# EAGLE design usb_hub (EAGLE 8.5.0)
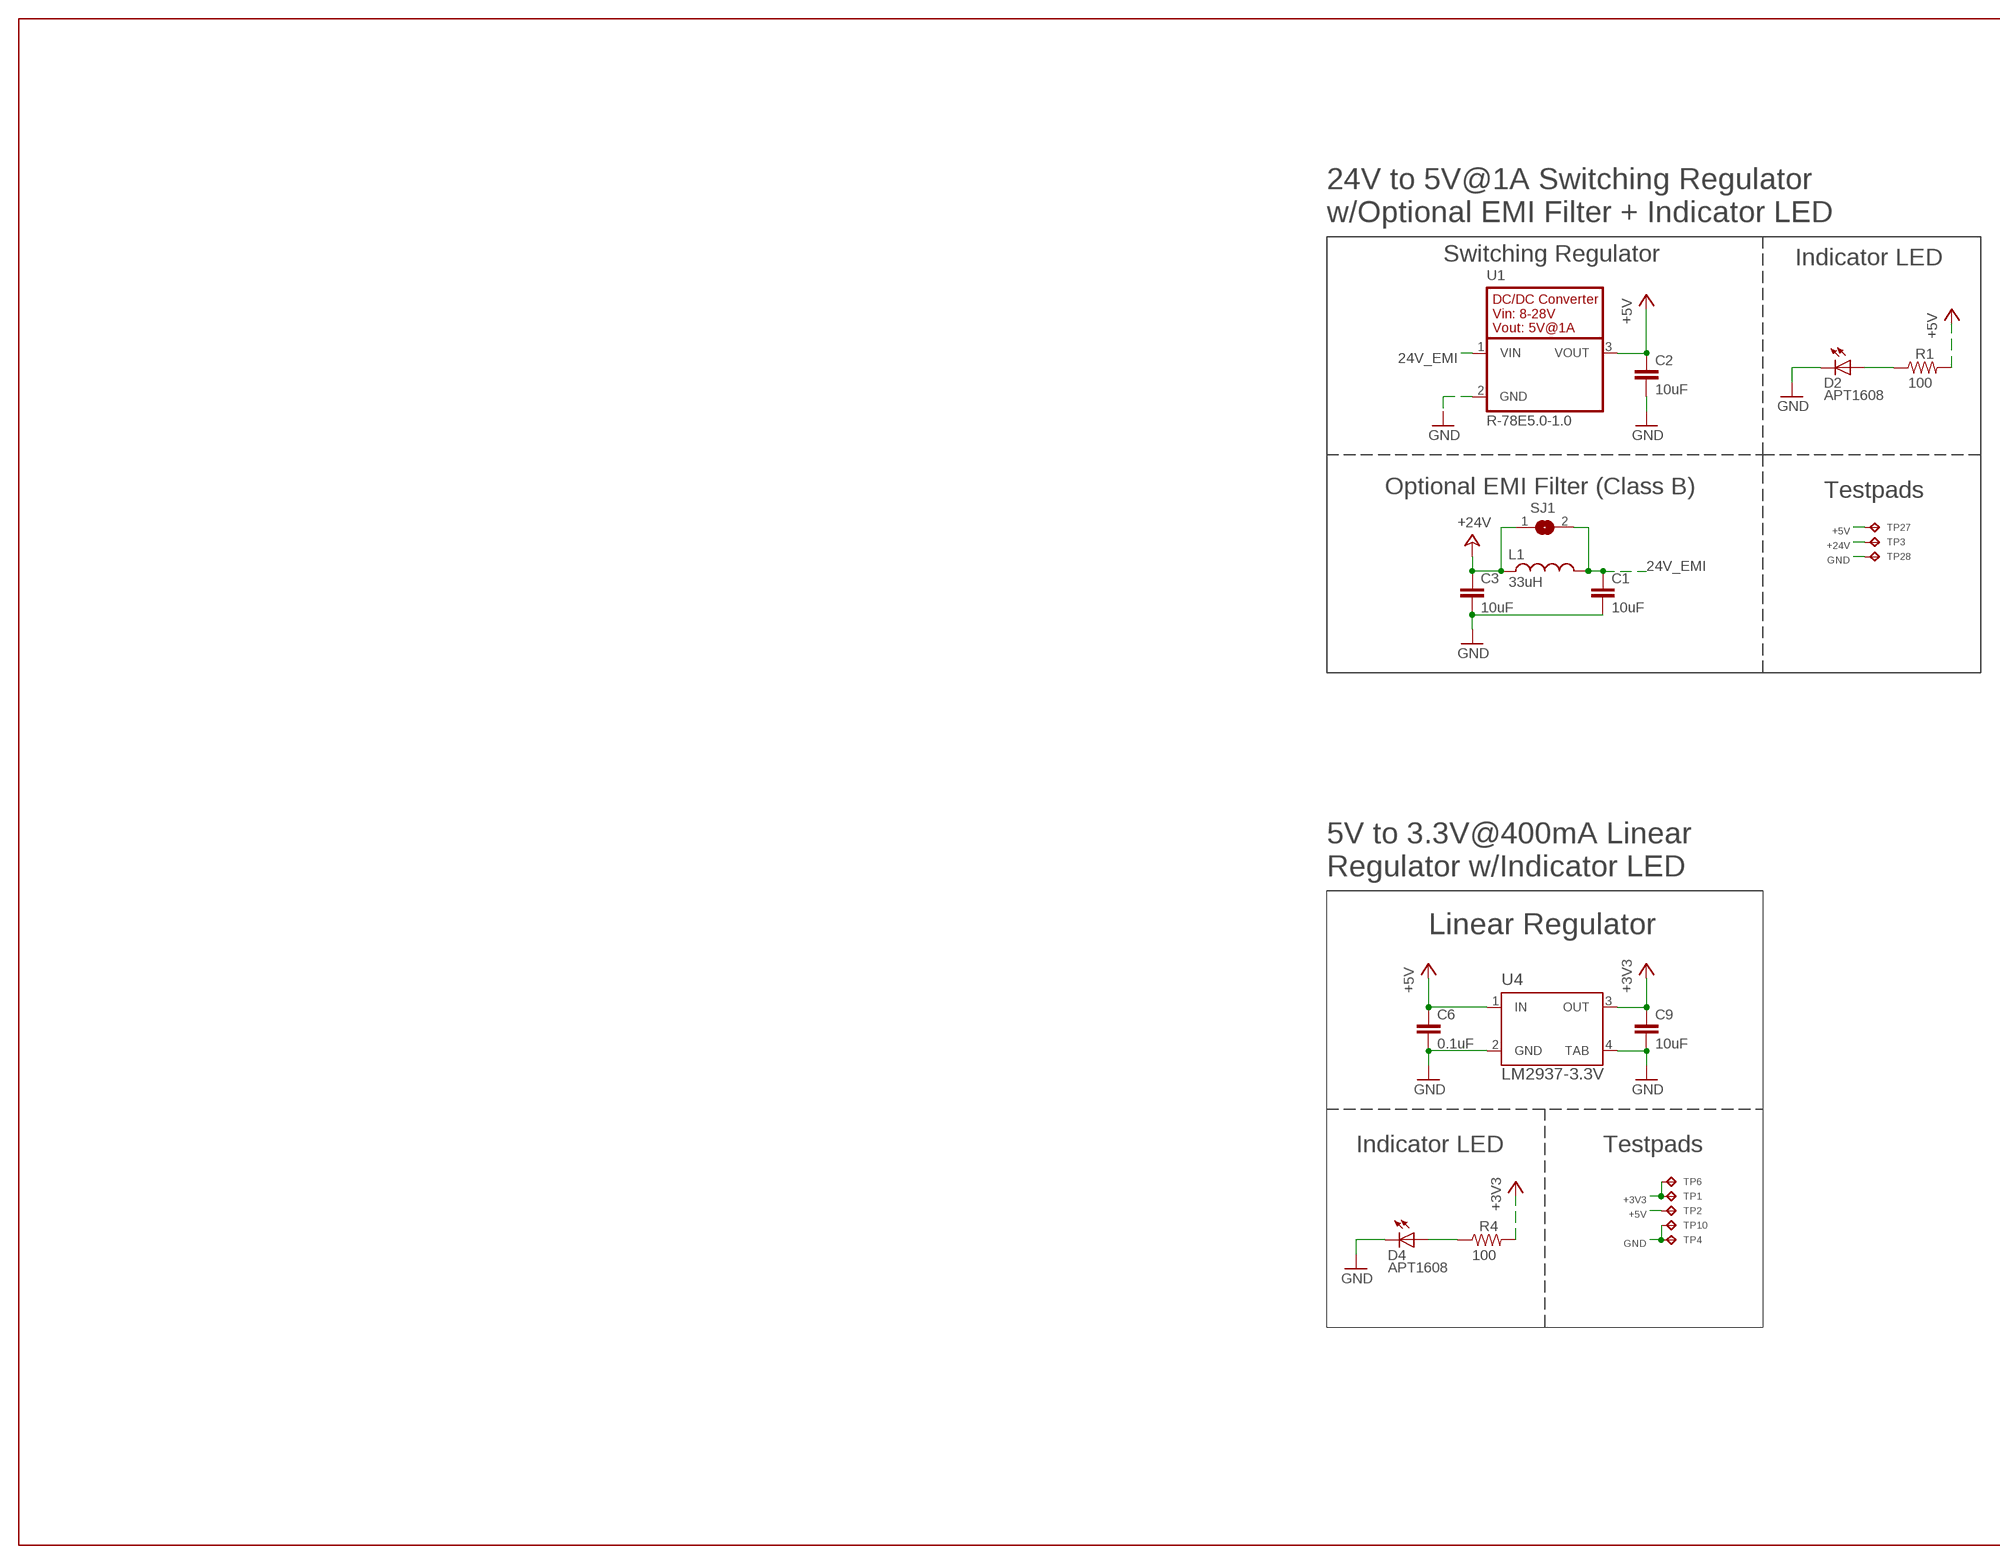
[diagram p0: schematic, sheet 1, part 1 of 2]
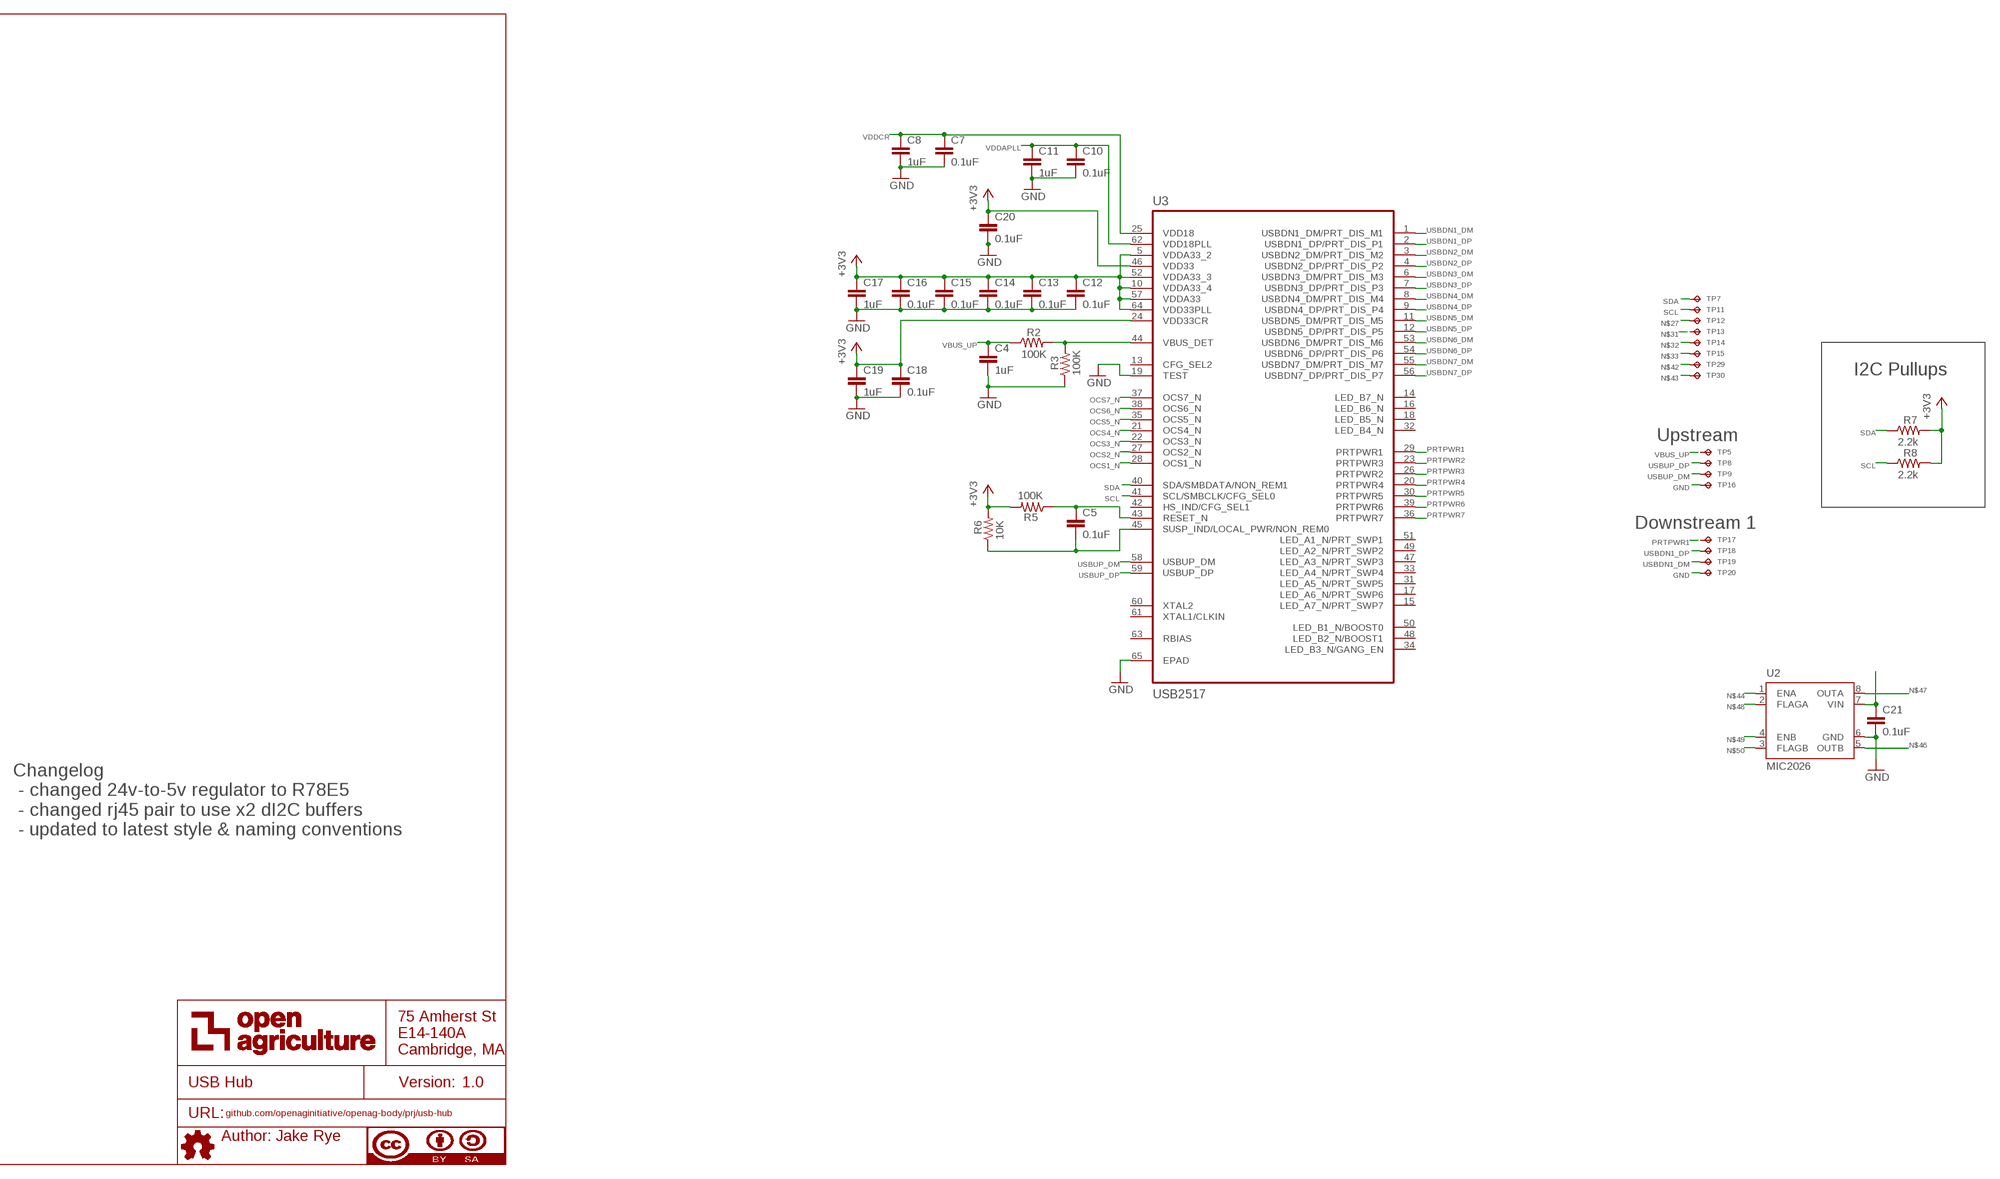
[diagram p1: schematic, sheet 1, part 2 of 2]

## Parts
C1  10uF  10UF-GMK212BBJ106KG-T  [C0805]
C2  10uF  10UF-GMK212BBJ106KG-T  [C0805]
C3  10uF  10UF-GMK212BBJ106KG-T  [C0805]
C4  1uF  1UF-CL10A105KB8NNNC  [C0603]
C5  0.1uF  0.1UF-C0603C104K5RACTU  [C0603]
C6  0.1uF  0.1UF-C0603C104K5RACTU  [C0603]
C7  0.1uF  0.1UF-C0603C104K5RACTU  [C0603]
C8  1uF  1UF-CL10A105KB8NNNC  [C0603]
C9  10uF  10UF-GMK212BBJ106KG-T  [C0805]
C10  0.1uF  0.1UF-C0603C104K5RACTU  [C0603]
C11  1uF  1UF-CL10A105KB8NNNC  [C0603]
C12  0.1uF  0.1UF-C0603C104K5RACTU  [C0603]
C13  0.1uF  0.1UF-C0603C104K5RACTU  [C0603]
C14  0.1uF  0.1UF-C0603C104K5RACTU  [C0603]
C15  0.1uF  0.1UF-C0603C104K5RACTU  [C0603]
C16  0.1uF  0.1UF-C0603C104K5RACTU  [C0603]
C17  1uF  1UF-CL10A105KB8NNNC  [C0603]
C18  0.1uF  0.1UF-C0603C104K5RACTU  [C0603]
C19  1uF  1UF-CL10A105KB8NNNC  [C0603]
C20  0.1uF  0.1UF-C0603C104K5RACTU  [C0603]
C21  0.1uF  0.1UF-C0603C104K5RACTU  [C0603]
D2  APT1608  APT1608CGCK  [CHIPLED_0603]
D4  APT1608  APT1608CGCK  [CHIPLED_0603]
L1  33uH  33UH-29333C  [29333C]
R1  100  100OHM-RC0603JR-07100RL  [RC0603N]
R2  100K  100K-RC0603FR-07100KL  [RC0603N]
R3  100K  100K-RC0603FR-07100KL  [RC0603N]
R4  100  100OHM-RC0603JR-07100RL  [RC0603N]
R5  100K  100K-RC0603FR-07100KL  [RC0603N]
R6  10K  10K-ERJ-3EKF1002V  [RC0603N]
R7  2.2k  2.2K-RC0603JR-072K2L  [RC0603N]
R8  2.2k  2.2K-RC0603JR-072K2L  [RC0603N]
SJ1  SOLDERJUMPERREFLOW_NOPASTE  [SJ1]
TP1  TPTP04R  [TP04R]
TP2  TPTP04R  [TP04R]
TP3  TPTP06R  [TP06R]
TP4  TPTP04R  [TP04R]
TP5  TPTP04R  [TP04R]
TP6  TPTP04R  [TP04R]
TP7  TPTP04R  [TP04R]
TP8  TPTP04R  [TP04R]
TP9  TPTP04R  [TP04R]
TP10  TPTP04R  [TP04R]
TP11  TPTP04R  [TP04R]
TP12  TPTP04R  [TP04R]
TP13  TPTP04R  [TP04R]
TP14  TPTP04R  [TP04R]
TP15  TPTP04R  [TP04R]
TP16  TPTP04R  [TP04R]
TP17  TPTP04R  [TP04R]
TP18  TPTP04R  [TP04R]
TP19  TPTP04R  [TP04R]
TP20  TPTP04R  [TP04R]
TP27  TPTP06R  [TP06R]
TP28  TPTP06R  [TP06R]
TP29  TPTP04R  [TP04R]
TP30  TPTP04R  [TP04R]
U1  R-78E5.0-1.0  [R-78E5.0-1.0]
U2  MIC2026  MIC2026-1YM-TR  [SOIC8]
U3  USB2517  USB2517-JZX  [QFN50P900X900X100-65N]
U4  LM2937-3.3V  LM2937IMP-3.3/NOPB  [MP04A]
U$6  AUTHOR  [AUTHOR]
U$7  TITLE  [TITLE]

## Nets
24V_EMI: C1.1 L1.2 SJ1.2 U1.1(VIN)
+3V3: C9.1 C12.1 C13.1 C14.1 C15.1 C16.1 C17.1 C18.1 C19.1 C20.1 R4.2 R5.2 R6.2 R7.2 R8.2 TP1.1(TP) TP6.1(TP) U3.5(VDDA33_2) U3.10(VDDA33_4) U3.24(VDD33CR) U3.46(VDD33) U3.52(VDDA33_3) U3.57(VDDA33) U3.64(VDD33PLL) U4.3(OUT)
+5V: C2.1 C6.1 R1.2 TP2.1(TP) TP27.TP U1.3(VOUT) U4.1(IN)
+24V: C3.1 L1.1 SJ1.1 TP3.TP
GND: C1.2 C2.2 C3.2 C4.2 C6.2 C7.2 C8.2 C9.2 C10.2 C11.2 C12.2 C13.2 C14.2 C15.2 C16.2 C17.2 C18.2 C19.2 C20.2 C21.2 D2.C D4.C R3.1 TP4.1(TP) TP10.1(TP) TP16.1(TP) TP20.1(TP) TP28.TP U1.2(GND) U2.6(GND) U3.19(TEST) U3.65(EPAD) U4.2(GND) U4.4(TAB)
N$4: R2.2 R3.2 U3.44(VBUS_DET)
N$5: D4.A R4.1
N$6: D2.A R1.1
N$7: C5.1 R5.1 U3.43(RESET_N)
N$11: C21.1 U2.7(VIN)
N$27: TP12.1(TP)
N$31: TP13.1(TP)
N$32: TP14.1(TP)
N$33: TP15.1(TP)
N$42: TP29.1(TP)
N$43: TP30.1(TP)
N$44: U2.1(ENA)
N$45: C5.2 R6.1 U3.45(SUSP_IND/LOCAL_PWR/NON_REM0)
N$46: U2.5(OUTB)
N$47: U2.8(OUTA)
N$48: U2.2(FLAGA)
N$49: U2.4(ENB)
N$50: U2.3(FLAGB)
OCS1_N: U3.28(OCS1_N)
OCS2_N: U3.27(OCS2_N)
OCS3_N: U3.22(OCS3_N)
OCS4_N: U3.21(OCS4_N)
OCS5_N: U3.35(OCS5_N)
OCS6_N: U3.38(OCS6_N)
OCS7_N: U3.37(OCS7_N)
PRTPWR1: TP17.1(TP) U3.29(PRTPWR1)
PRTPWR2: U3.23(PRTPWR3)
PRTPWR3: U3.26(PRTPWR2)
PRTPWR4: U3.20(PRTPWR4)
PRTPWR5: U3.30(PRTPWR5)
PRTPWR6: U3.39(PRTPWR6)
PRTPWR7: U3.36(PRTPWR7)
SCL: R8.1 TP11.1(TP) U3.41(SCL/SMBCLK/CFG_SEL0)
SDA: R7.1 TP7.1(TP) U3.40(SDA/SMBDATA/NON_REM1)
USBDN1_DM: TP19.1(TP) U3.1(USBDN1_DM/PRT_DIS_M1)
USBDN1_DP: TP18.1(TP) U3.2(USBDN1_DP/PRT_DIS_P1)
USBDN2_DM: U3.3(USBDN2_DM/PRT_DIS_M2)
USBDN2_DP: U3.4(USBDN2_DP/PRT_DIS_P2)
USBDN3_DM: U3.6(USBDN3_DM/PRT_DIS_M3)
USBDN3_DP: U3.7(USBDN3_DP/PRT_DIS_P3)
USBDN4_DM: U3.8(USBDN4_DM/PRT_DIS_M4)
USBDN4_DP: U3.9(USBDN4_DP/PRT_DIS_P4)
USBDN5_DM: U3.11(USBDN5_DM/PRT_DIS_M5)
USBDN5_DP: U3.12(USBDN5_DP/PRT_DIS_P5)
USBDN6_DM: U3.53(USBDN6_DM/PRT_DIS_M6)
USBDN6_DP: U3.54(USBDN6_DP/PRT_DIS_P6)
USBDN7_DM: U3.55(USBDN7_DM/PRT_DIS_M7)
USBDN7_DP: U3.56(USBDN7_DP/PRT_DIS_P7)
USBUP_DM: TP9.1(TP) U3.58(USBUP_DM)
USBUP_DP: TP8.1(TP) U3.59(USBUP_DP)
VBUS_UP: C4.1 R2.1 TP5.1(TP)
VDDAPLL: C10.1 C11.1 U3.62(VDD18PLL)
VDDCR: C7.1 C8.1 U3.25(VDD18)
Unconnected: U3.13(CFG_SEL2) U3.14(LED_B7_N) U3.15(LED_A7_N/PRT_SWP7) U3.16(LED_B6_N) U3.17(LED_A6_N/PRT_SWP6) U3.18(LED_B5_N) U3.31(LED_A5_N/PRT_SWP5) U3.32(LED_B4_N) U3.33(LED_A4_N/PRT_SWP4) U3.34(LED_B3_N/GANG_EN) U3.42(HS_IND/CFG_SEL1) U3.47(LED_A3_N/PRT_SWP3) U3.48(LED_B2_N/BOOST1) U3.49(LED_A2_N/PRT_SWP2) U3.50(LED_B1_N/BOOST0) U3.51(LED_A1_N/PRT_SWP1) U3.60(XTAL2) U3.61(XTAL1/CLKIN) U3.63(RBIAS)

## Notes on the sheet
- 24V to 5V@1A Switching Regulator
  w/Optional EMI Filter + Indicator LED
- Switching Regulator | Indicator LED
- Optional EMI Filter (Class B) | Testpads | I2C Pullups
- Upstream
- Downstream 1
- 5V to 3.3V@400mA Linear 
  Regulator w/Indicator LED
- Linear Regulator
- Changelog
   - changed 24v-to-5v regulator to R78E5
   - changed rj45 pair to use x2 dI2C buffers
   - updated to latest style & naming conventions
- Indicator LED | Testpads

## Library data of the parts
C1-C3 C9 = openag-capacitors:10UF-GMK212BBJ106KG-T: CAP CER 10UF 35V X5R 0805 Description: 10µF ±10% 35V Ceramic Capacitor X5R 0805 (2012 Metric) Technical Specifications: Capacitance: 10µF Tolerance: ±10% Rated Voltage: 35V Temperature Coefficient: X5R Operating Temperature: -55°C ~ 85°C Package / Case: 0805 (2012 Metric) Datasheet(s): GMK212BBJ106KG-T Spec <http://ds.yuden.co.jp/TYCOMPAS/ut/detail.do?productNo=GMK212BBJ106KG-T&fileName=GMK212BBJ106KG-T_SS&mode=specSheetDownload> Vendor(s): Digikey: 587-4893-1-ND <https://www.digikey.com/product-detail/en/taiyo-yuden/GMK212BBJ106KG-T/587-4893-1-ND/6563736>; MANUFACTURER: Taiyo Yuden; MPN: GMK212BBJ106KG-T; VENDOR: Digikey; VLINK: https://www.digikey.com/product-detail/en/taiyo-yuden/GMK212BBJ106KG-T/587-4893-1-ND/6563736; VPN: 587-4893-1-ND
C4 C8 C11 C17 C19 = openag-capacitors:1UF-CL10A105KB8NNNC: CAP CER 1UF 50V X5R 0603 Description: 1µF ±10% 50V Ceramic Capacitor X5R 0603 (1608 Metric) Technical Specifications: Capacitance: 1µF Tolerance: ±10% Voltage - Rated: 50V Temperature Coefficient: X5R Operating Temperature: -55°C ~ 85°C Applications: General Purpose Mounting Type: Surface Mount, MLCC Package / Case: 0603 (1608 Metric) Size / Dimension: 0.063" L x 0.032" W (1.60mm x 0.80mm) Thickness (Max): 0.035" (0.90mm) Datasheet(s): CL10A105KB8NNNC Spec <http://www.samsungsem.com/kr/support/product-search/mlcc/CL10A105KB8NNNC.jsp> CL10A105KB8NNNC Characteristics <http://www.samsungsem.com/kr/front/downloadcms.do?path=/kr/support/product-search/mlcc/__icsFiles/afieldfile/2014/11/05&fileName=C_CL10A105KB8NNNC.pdf> MLCC Catalog <http://www.samsungsem.com/kr/support/library/product-catalog/mlcc.jsp> Vendor(s): Digikey: 1276-1860-1-ND <https://www.digikey.com/product-detail/en/samsung-electro-mechanics-america-inc/CL10A105KB8NNNC/1276-1860-1-ND/3889946>; MANUFACTURER: Samsung Electro-Mechanics; MPN: CL10A105KB8NNNC; VENDOR: Digikey; VLINK: https://www.digikey.com/product-detail/en/samsung-electro-mechanics-america-inc/CL10A105KB8NNNC/1276-1860-1-ND/3889946; VPN: 1276-1860-1-ND
C5-C7 C10 C12-C16 C18 C20 C21 = openag-capacitors:0.1UF-C0603C104K5RACTU: CAP CER 0.1UF 50V X7R 0603 Description: 0.1µF ±10% 50V Ceramic Capacitor X7R 0603 (1608 Metric) Technical Specifications: Capacitance: 0.1µF Tolerance: ±10% Rated Voltage: 50V Temperature Coefficient: X7R Operating Temperature: -55°C ~ 125°C Package / Case: 0603 (1608 Metric) Datasheet(s): X7R Dielectric, 6.3-250 VDC <https://search.kemet.com/component-edge/download/datasheet/C0603C104K5RACTU.pdf> Vendor(s): Digikey: 399-5089-1-ND <https://www.digikey.com/product-detail/en/kemet/C0603C104K5RACTU/399-5089-1-ND/1465623>; MANUFACTURER: Kemet; MPN: C0603C104K5RACTU; VENDOR: Digikey; VLINK: https://www.digikey.com/product-detail/en/kemet/C0603C104K5RACTU/399-5089-1-ND/1465623; VPN: 399-5089-1-ND
D2 D4 = openag-diodes:APT1608CGCK: LED GREEN CLEAR 0603 SMD Description: Green 570nm LED Indication - Discrete 2.1V 0603 (1608 Metric) Technical Specifications: Color: Green Lens Color: Colorless Lens Transparency: Clear Millicandela Rating: 50mcd Lens Style/Size: Rectangle with Flat Top, 1.20mm x 0.80mm Voltage - Forward (Vf) (Typ): 2.1V Current - Test: 20mA Viewing Angle: 120° Mounting Type: Surface Mount Wavelength - Dominant: 570nm Wavelength - Peak: 574nm Package / Case: 0603 (1608 Metric) Supplier Device Package: Chip LED Size / Dimension: 1.60mm L x 0.80mm W Height (Max): 0.75mm Datasheet(s): APT1608CGCK <http://www.kingbrightusa.com/images/catalog/SPEC/APT1608CGCK.pdf> Vendor(s): Digikey: 754-1116-1-ND <https://www.digikey.com/product-detail/en/kingbright/APT1608CGCK/754-1116-1-ND/1747833#>; MANUFACTURER: Kingbright; MPN: APT1608CGCK; VENDOR: Digikey; VLINK: https://www.digikey.com/product-detail/en/kingbright/APT1608CGCK/754-1116-1-ND/1747833#; VPN: 754-1116-1-ND
L1 = openag-inductors:33UH-29333C: FIXED IND 33UH 1A 120 MOHM SMD Description: 33µH Shielded Wirewound Inductor 1A 120 mOhm Max Nonstandard Technical Specifications: Type: Wirewound Inductance: 33µH Current Rating: 1A Shielding: Shielded DC Resistance (DCR): 120 mOhm Max Operating Temperature: -40°C ~ 85°C Frequency - Test: 10kHz Mounting Type: Surface Mount Package / Case: Nonstandard Size / Dimension: 0.283" L x 0.283" W (7.20mm x 7.20mm) Height - Seated (Max): 0.157" (4.00mm) Datasheet(s): 2900 Series <https://www.murata-ps.com/data/magnetics/kmp_2900.pdf> Vendor(s): Digikey: 811-1138-1-ND <https://www.digikey.com/product-detail/en/murata-power-solutions-inc/29333C/811-1138-1-ND/1924860>; MANUFACTURER: Murata Power Solutions Inc.; MPN: 29333C; VENDOR: Digikey; VLINK: https://www.digikey.com/product-detail/en/murata-power-solutions-inc/29333C/811-1138-1-ND/1924860; VPN: 811-1138-1-ND
R1 R4 = openag-resistors:100OHM-RC0603JR-07100RL: RES SMD 100 OHM 5% 1/10W 0603 Description: 100 Ohms ±5% 0.1W, 1/10W Chip Resistor 0603 (1608 Metric) Moisture Resistant Thick Film Technical Specifications: Resistance: 100 Ohms Tolerance: ±5% Power (Watts): 0.1W, 1/10W Composition: Thick Film Features: Moisture Resistant Temperature Coefficient: ±100ppm/°C Operating Temperature: -55°C ~ 155°C Package / Case: 0603 (1608 Metric) Supplier Device Package: 0603 Size / Dimension: 0.063" L x 0.032" W (1.60mm x 0.80mm) Height - Seated (Max): 0.022" (0.55mm) Number of Terminations: 2 Datasheet(s): Thick Film Chip Resistor Intro <http://www.yageo.com.tw/exep/pages/download/literatures/PYu-R_INT-thick_7.pdf> Chip Resistor Marking <http://www.yageo.com/exep/pages/download/literatures/PYu-R_Marking_2.pdf> RC Series, L Datasheet <http://www.yageo.com/documents/recent/PYu-RC_Group_51_RoHS_L_8.pdf> Vendor(s): Digikey: 311-100GRCT-ND <https://www.digikey.com/product-detail/en/yageo/RC0603JR-07100RL/311-100GRCT-ND/729644>; MANUFACTURER: Yageo; MPN: RC0603JR-07100RL; VENDOR: Digikey; VLINK: https://www.digikey.com/product-detail/en/yageo/RC0603JR-07100RL/311-100GRCT-ND/729644; VPN: 311-100GRCT-ND
R2 R3 R5 = openag-resistors:100K-RC0603FR-07100KL: Yageo - RC0603FR-07100KL- RES SMD 100K OHM 1% 1/10W 0603 Description: 100 kOhms ±1% 0.1W, 1/10W Chip Resistor 0603 (1608 Metric) Moisture Resistant Thick Film Technical Specifications: Resistance: 100 kOhms Tolerance: ±1% Power: 0.1W, 1/10W Temperature Coefficient: ±100ppm/°C Operating Temperature: -55°C ~ 155°C Package / Case: 0603 (1608 Metric) Datasheet(s): RC Series, L Datasheet <http://www.yageo.com/documents/recent/PYu-RC_Group_51_RoHS_L_7.pdf> Vendor(s): Digikey: 311-100KHRCT-ND <https://www.digikey.com/product-detail/en/yageo/RC0603FR-07100KL/311-100KHRCT-ND/729836>; POPULATE: YES; VERIFIED: NO
R6 = openag-resistors:10K-ERJ-3EKF1002V: RES SMD 10K OHM 1% 1/10W 0603 Description: 10 kOhms ±1% 0.1W, 1/10W Chip Resistor 0603 (1608 Metric) Automotive AEC-Q200 Thick Film Technical Specifications: Resistance: 10kOhms Tolerance: ±1% Power: 0.1W, 1/10W Operating Temperature: -55°C ~ 155°C Package/Case: 0603 (1608 Metric) Datasheet(s): ERJ-3EKF1002V View All Specifications <https://industrial.panasonic.com/ww/products/resistors/chip-resistors/general-purpose-chip-resistors/precision-thick-film-chip-resistors/ERJ3EKF1002V> Vendor(s): Digikey: P10.0KHCT-ND <https://www.digikey.com/product-detail/en/panasonic-electronic-components/ERJ-3EKF1002V/P10.0KHCT-ND/198102>; MANUFACTURER: Panasonic; MPN: ERJ-3EKF1002V; VENDOR: Digikey; VLINK: https://www.digikey.com/product-detail/en/panasonic-electronic-components/ERJ-3EKF1002V/P10.0KHCT-ND/198102; VPN: P10.0KHCT-ND
R7 R8 = openag-resistors:2.2K-RC0603JR-072K2L: RES SMD 2.2K OHM 5% 1/10W 0603 Description: 2.2 kOhms ±5% 0.1W, 1/10W Chip Resistor 0603 (1608 Metric) Moisture Resistant Thick Film Technical Specifications: Resistance: 2.2 kOhms Tolerance: ±5% Power (Watts): 0.1W, 1/10W Composition: Thick Film Features: Moisture Resistant Temperature Coefficient: ±100ppm/°C Operating Temperature: -55°C ~ 155°C Package / Case: 0603 (1608 Metric) Supplier Device Package: 0603 Size / Dimension: 0.063" L x 0.032" W (1.60mm x 0.80mm) Height - Seated (Max): 0.022" (0.55mm) Number of Terminations: 2 Datasheet(s): RC Series, L Datasheet <http://www.yageo.com/documents/recent/PYu-RC_Group_51_RoHS_L_8.pdf> Chip Resistor Marking <http://www.yageo.com/exep/pages/download/literatures/PYu-R_Marking_2.pdf> Vendor(s): Digikey: 311-2.2KGRCT-ND <https://www.digikey.com/product-detail/en/yageo/RC0603JR-072K2L/311-2.2KGRCT-ND/729676#>; MANUFACTURER: Yageo; MPN: RC0603JR-072K2L; VENDOR: Digikey; VLINK: https://www.digikey.com/product-detail/en/yageo/RC0603JR-072K2L/311-2.2KGRCT-ND/729676#; VPN: 311-2.2KGRCT-ND
SJ1 = openag-connectors:SOLDERJUMPER: SMD Solder JUMPER Solder the two pads together to create a connection, or remove the solder to break it. REFLOW - Use this footprint for solder paste and reflow ovens. WAVE - Use this footprint for hand-soldering (larger pads). CLOSED - Has a trace between the two pads to ensure it is closed by default. The trace needs to be cut to disable the jumper, and can be closed again by creating a solder bridge between the two pads.; MPN: N/A
TP1-TP20 TP27-TP30 = openag-testpads:TP: Test pad; MPN: N/A
U1 = openag-regulators:R-78E5.0-1.0: DC/DC CONVERTER 5V 5W Description: Linear Regulator Replacement DC DC Converter 1 Output 5V 1A 8V - 28V Input Technical Specifications: Type: Linear Regulator Replacement Number of Outputs: 1 Voltage - Input (Min): 8V Voltage - Input (Max): 28V Voltage - Output 1: 5V Current - Output (Max): 1A Power (Watts): 5W Applications: ITE (Commercial) Features: SCP Operating Temperature: -40°C ~ 85°C Efficiency: 91% Mounting Type: Through Hole Package / Case: 3-SIP Module Size / Dimension: 0.46" L x 0.33" W x 0.41" H (11.6mm x 8.5mm x 10.4mm) Datasheet(s): R-78E-1.0 Series Datasheet <https://www.recom-power.com/pdf/Innoline/R-78Exx-1.0.pdf> Vendor(s): Digikey: 945-2201-ND <https://www.digikey.com/product-detail/en/recom-power/R-78E5.0-1.0/945-2201-ND/4930585>; MANUFACTURER: Recom Power; MPN: R-78E5.0-1.0; VENDOR: Digikey; VLINK: https://www.digikey.com/product-detail/en/recom-power/R-78E5.0-1.0/945-2201-ND/4930585; VPN: 945-2201-ND
U2 = openag-power-distributors:MIC2026-1YM-TR: IC SW DISTRIBUTION 2CHAN 8SOIC Description: IC CONTROLLER USB 36QFN Technical Specifications: Switch Type: General Purpose Number of Outputs: 2 Ratio - Input:Output: 1:2 Output Configuration: High Side Output Type: N-Channel Interface: On/Off Voltage - Load: 2.7 V ~ 5.5 V Voltage - Supply (Vcc/Vdd): Not Required Current - Output (Max): 500mA Rds On (Typ): 90 mOhm Input Type: Non-Inverting Features: Slew Rate Controlled, Status Flag Fault Protection: Current Limiting (Fixed), Over Temperature, UVLO Operating Temperature: -40°C ~ 85°C (TA) Package / Case: 8-SOIC (0.154", 3.90mm Width) Supplier Device Package: 8-SOIC Base Part Number: MIC2026 Datasheet(s): MIC2026, MIC2076 <http://www.microchip.com/mymicrochip/filehandler.aspx?ddocname=en579448> Vendor(s): Digikey: 576-1059-1-ND <https://www.digikey.com/product-detail/en/microchip-technology/MIC2026-1YM-TR/576-1059-1-ND/771825>; MANUFACTURER: Microchip Technology; MPN: MIC2026-1YM-TR; VENDOR: Digikey; VLINK: https://www.digikey.com/product-detail/en/microchip-technology/MIC2026-1YM-TR/576-1059-1-ND/771825; VPN: 576-1059-1-ND
U3 = openag-hubs:USB2517-JZX: IC USB 2.0 7PORT HUB CTLR 64QFN Description: USB Hub Controller USB 2.0 USB Interface 64-QFN (9x9) Technical Specifications: Protocol: USB Function: Hub Controller Interface: USB Standards: USB 2.0 Voltage - Supply: 3 V ~ 3.6 V Current - Supply: 130mA Operating Temperature: 0°C ~ 70°C Package / Case: 64-VFQFN Exposed Pad Supplier Device Package: 64-QFN (9x9) Base Part Number: USB2517 Datasheet(s): USB2517(I) Datasheet <http://ww1.microchip.com/downloads/en/DeviceDoc/00001598B.pdf> USB251x Family Brochure <http://www.microchip.com/mymicrochip/filehandler.aspx?ddocname=en562207> USB2517 Data Brief <http://www.microchip.com/mymicrochip/filehandler.aspx?ddocname=en562021> Vendor(s): Digikey: USB2517-JZX-CT-ND <https://www.digikey.com/product-detail/en/microchip-technology/USB2517-JZX-TR/USB2517-JZX-CT-ND/5043020>; MANUFACTURER: Microchip Technology; MPN: USB2517-JZX; VENDOR: Digikey; VLINK: https://www.digikey.com/product-detail/en/microchip-technology/USB2517-JZX-TR/USB2517-JZX-CT-ND/5043020; VPN: USB2517-JZX-CT-ND
U4 = openag-regulators:LM2937IMP-3.3/NOPB: IC REG LIN 3.3V 400MA SOT223-4 Description: Linear Voltage Regulator IC Positive Fixed 1 Output 3.3V 400mA SOT-223-4 Technical Specifications: Output Configuration: Positive Output Type: Fixed Number of Regulators: 1 Voltage - Input (Max): 26V Voltage - Output (Min/Fixed): 3.3V Voltage Dropout (Max): 1V @ 50mA Current - Output: 400mA Current - Quiescent (Iq): 2mA Current - Supply (Max): 1.25A Protection Features: Over Temperature, Reverse Polarity, Short Circuit Operating Temperature: -40°C ~ 85°C Mounting Type: Surface Mount Package / Case: TO-261-4, TO-261AA Supplier Device Package: SOT-223-4 Base Part Number: LM2937 Datasheet(s): LM2937-2.5, LM2937-3.3 Datasheet <http://www.ti.com/lit/ds/symlink/lm2937-2.5.pdf> Vendor(s): Digikey: LM2937IMP-3.3/NOPBCT-ND <https://www.digikey.com/product-detail/en/texas-instruments/LM2937IMP-3.3-NOPB/LM2937IMP-3.3-NOPBCT-ND/270742#>; MANUFACTURER: Texas Instruments; MPN: LM2937IMP-3.3/NOPB; VENDOR: Digikey; VLINK: https://www.digikey.com/product-detail/en/texas-instruments/LM2937IMP-3.3-NOPB/LM2937IMP-3.3-NOPBCT-ND/270742#; VPN: LM2937IMP-3.3/NOPBCT-ND
U$6 = openag-frames:AUTHOR; AUTHOR: Jake Rye; MPN: N/A
U$7 = openag-frames:TITLE; MPN: N/A; TITLE: USB Hub; URL: github.com/openaginitiative/openag-body/prj/usb-hub; VER: 1.0

## Board
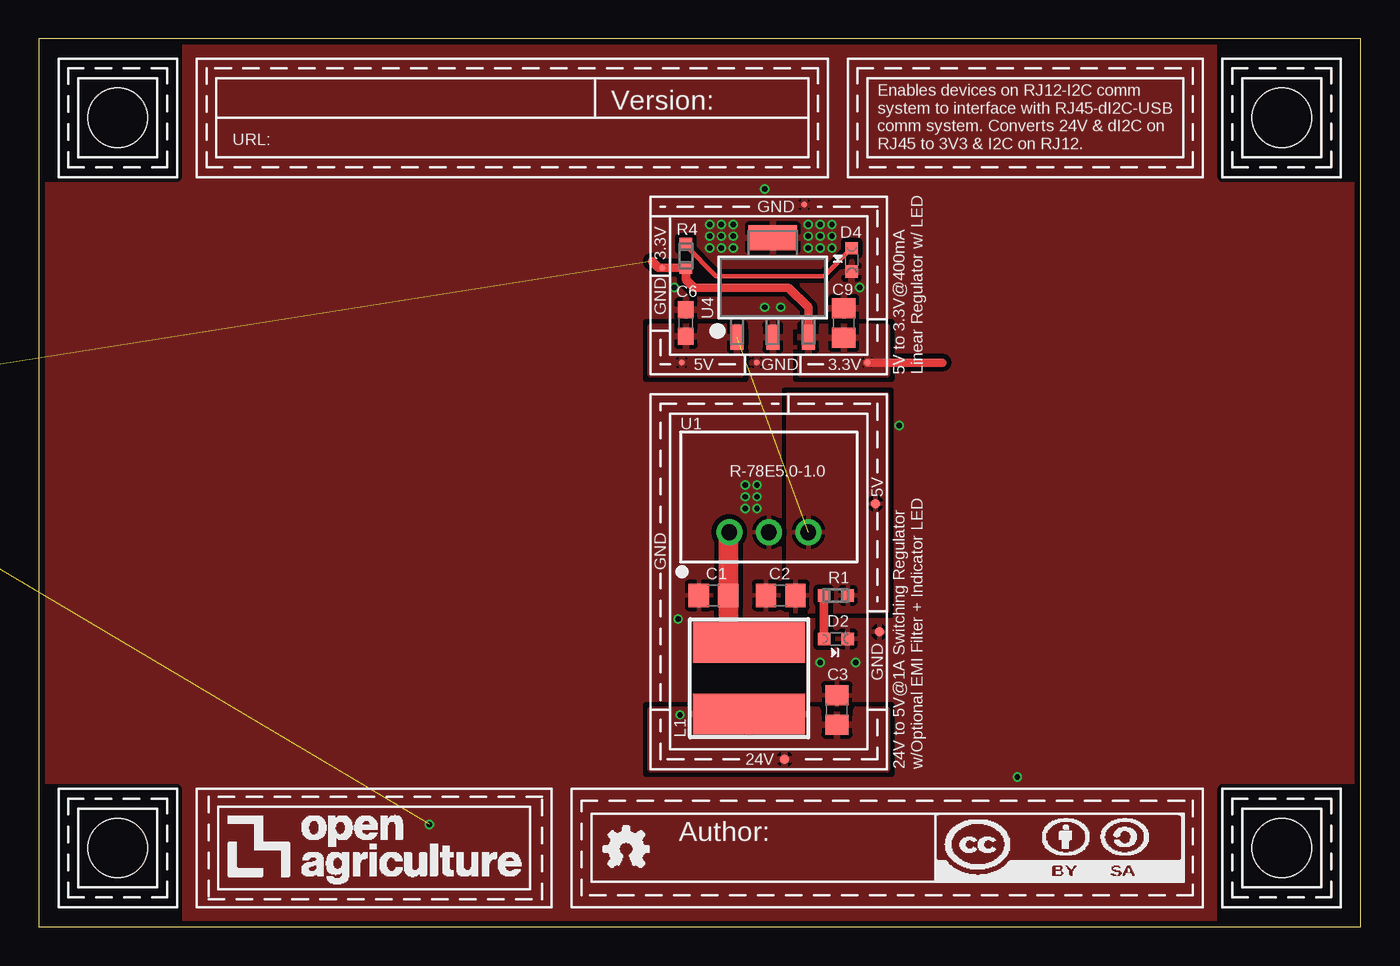
[diagram p2: board, top side]
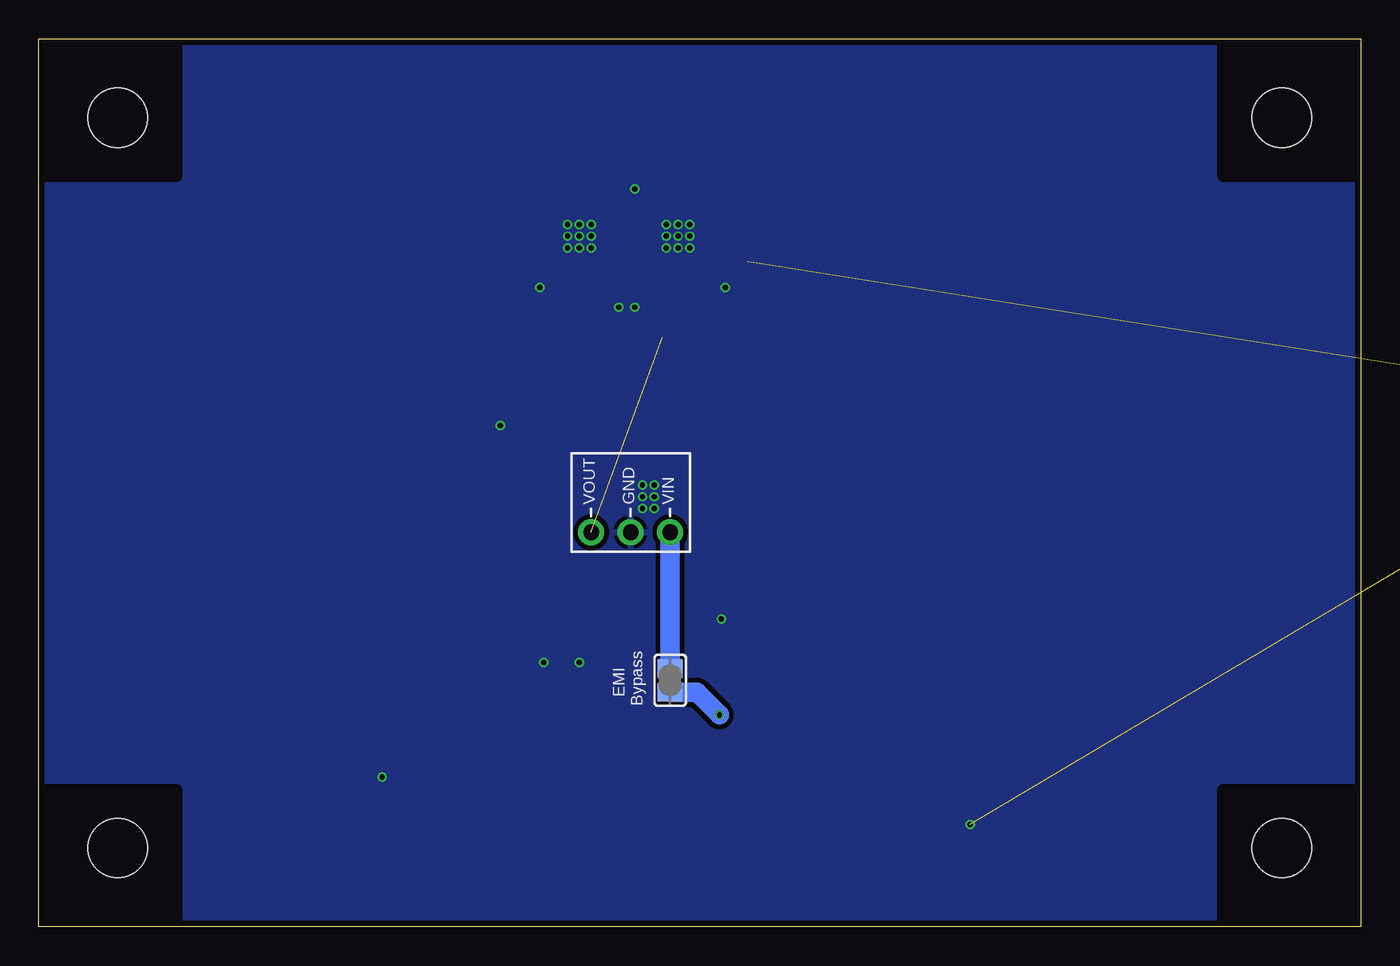
[diagram p3: board, bottom side, seen from below]

Size 85.09 x 57.15 mm. Coordinates in mm from the lower left corner, seen from the top.
Outline: 0,0 85.09,0 85.09,57.15 0,57.15 0,0
Copper layers (1*16): Top 0.035559375mm / dielectric 1.6mm / Bottom 0.035559375mm
Design rules "oshpark-2layer-mask": minimum track width 6mil, minimum drill 10mil, track to track 6mil, track to pad 6mil, pad to pad 6mil, via to via 6mil, smd to smd 6mil, copper to edge 15mil, drill to drill 6mil, minimum pad ring 5mil, minimum via ring 5mil, stop-mask expansion 2.5mil, vias tented up to drill 20mil, thermal gap 10mil
tRestrict: 2 lines

### Footprints (pad centres in the part's own frame; a part is rotated, then mirrored left to right if it is on the bottom)
C0805 = smd 1.3 x 1.5: 1 -0.95,0; 2 0.95,0
C0603 = smd 1.1 x 1: 1 -0.85,0; 2 0.85,0
CHIPLED_0603 = smd 0.8 x 0.8: A 0,-0.75; C 0,0.75
29333C = smd 2.6 x 7.2: 1 -2.3,0; 2 2.3,0
RC0603N = smd 0.756 x 0.8: 1 -0.778,0; 2 0.778,0
SJ1 = smd 1.168 x 1.6: 1 -0.762,0; 2 0.762,0
TP04R = smd 0.4 x 0.4: 1 0,0
TP06R = smd 0.6 x 0.6: TP 0,0
R-78E5.0-1.0 = drill 1 pad 1.676: 1 -2.54,0; 2 0,0; 3 2.54,0
SOIC8 = smd 0.6 x 2.2: 1 -1.905,-2.6; 2 -0.635,-2.6; 3 0.635,-2.6; 4 1.905,-2.6; 5 1.905,2.6; 6 0.635,2.6; 7 -0.635,2.6; 8 -1.905,2.6
QFN50P900X900X100-65N = smd 0.813 x 0.305: 1 -4.394,3.759; 2 -4.394,3.251; 3 -4.394,2.743; 4 -4.394,2.261; 5 -4.394,1.753; 6 -4.394,1.245; 7 -4.394,0.762; 8 -4.394,0.254; 9 -4.394,-0.254; 10 -4.394,-0.762; 11 -4.394,-1.245; 12 -4.394,-1.753; 13 -4.394,-2.261; 14 -4.394,-2.743; 15 -4.394,-3.251; 16 -4.394,-3.759; 33 4.394,-3.759; 34 4.394,-3.251; 35 4.394,-2.743; 36 4.394,-2.261; 37 4.394,-1.753; 38 4.394,-1.245; 39 4.394,-0.762; 40 4.394,-0.254; 41 4.394,0.254; 42 4.394,0.762; 43 4.394,1.245; 44 4.394,1.753; 45 4.394,2.261; 46 4.394,2.743; 47 4.394,3.251; 48 4.394,3.759 | smd 0.305 x 0.813: 17 -3.759,-4.394; 18 -3.251,-4.394; 19 -2.743,-4.394; 20 -2.261,-4.394; 21 -1.753,-4.394; 22 -1.245,-4.394; 23 -0.762,-4.394; 24 -0.254,-4.394; 25 0.254,-4.394; 26 0.762,-4.394; 27 1.245,-4.394; 28 1.753,-4.394; 29 2.261,-4.394; 30 2.743,-4.394; 31 3.251,-4.394; 32 3.759,-4.394; 49 3.759,4.394; 50 3.251,4.394; 51 2.743,4.394; 52 2.261,4.394; 53 1.753,4.394; 54 1.245,4.394; 55 0.762,4.394; 56 0.254,4.394; 57 -0.254,4.394; 58 -0.762,4.394; 59 -1.245,4.394; 60 -1.753,4.394; 61 -2.261,4.394; 62 -2.743,4.394; 63 -3.251,4.394; 64 -3.759,4.394 | smd 6.35 x 6.35: 65 0,0
MP04A = smd 1.6 x 0.838: 1 -3.2,2.3; 2 -3.2,0; 3 -3.2,-2.3 | smd 1.6 x 3.099: 4 3.2,0
CORNER = hole 3.81: 0,0

### Placement (x,y rotation side)
C1  43.43,21.34 180 top
C2  47.75,21.34 180 top
C3  51.37,13.97 90 top
C4  -27.69,29.78 90 top  (outside the outline)
C5  -31.75,36.2 90 top  (outside the outline)
C6  41.66,38.86 90 top
C7  -38.1,22.54 0 top  (outside the outline)
C8  -38.1,19.05 0 top  (outside the outline)
C9  51.82,38.86 90 top
C10  -42.86,39.69 180 top  (outside the outline)
C11  -42.86,43.5 180 top  (outside the outline)
C12  -45.72,29.53 270 top  (outside the outline)
C13  -46.35,34.61 90 top  (outside the outline)
C14  -46.35,38.42 180 top  (outside the outline)
C15  -35.88,38.42 0 top  (outside the outline)
C16  -39.05,38.73 90 top  (outside the outline)
C17  -48.58,31.43 180 top  (outside the outline)
C18  -41.91,22.54 180 top  (outside the outline)
C19  -41.91,19.05 180 top  (outside the outline)
C20  -41.91,15.88 180 top  (outside the outline)
C21  -60.33,-40.64 0 top  (outside the outline)
D2  51.31,18.54 270 top
D4  52.32,42.93 180 top
L1  45.72,16 90 top
R1  51.31,21.34 0 top
R2  -29.97,29.02 180 top  (outside the outline)
R3  -29.97,30.54 180 top  (outside the outline)
R4  41.66,43.18 270 top
R5  -28.26,36.2 90 top  (outside the outline)
R6  -29.84,39.37 0 top  (outside the outline)
R7  -17.78,30.16 270 top  (outside the outline)
R8  -17.78,33.02 90 top  (outside the outline)
SJ1  44.45,15.88 90 bottom
TP1  40.13,42.42 0 top
TP2  41.4,36.32 0 top
TP3  48.01,10.79 0 top
TP4  49.28,46.48 0 top
TP5  -23.5,33.85 0 top  (outside the outline)
TP6  53.34,36.32 0 top
TP7  -23.5,31.43 0 top  (outside the outline)
TP8  -40.51,41.34 0 top  (outside the outline)
TP9  -39.69,41.4 0 top  (outside the outline)
TP10  46.23,36.32 0 top
TP11  -23.5,32.38 0 top  (outside the outline)
TP12  1.27,-20.32 0 top  (outside the outline)
TP13  1.27,-22.86 0 top  (outside the outline)
TP14  1.27,-25.4 0 top  (outside the outline)
TP15  1.27,-27.94 0 top  (outside the outline)
TP16  -23.56,35.5 0 top  (outside the outline)
TP17  -56.2,-35.24 0 top  (outside the outline)
TP18  -53.98,-35.24 0 top  (outside the outline)
TP19  -56.2,-37.47 0 top  (outside the outline)
TP20  -53.98,-37.47 0 top  (outside the outline)
TP27  53.85,27.24 0 top
TP28  54.1,18.99 0 top
TP29  1.27,-30.48 0 top  (outside the outline)
TP30  1.27,-33.02 0 top  (outside the outline)
U1  46.99,25.4 0 top
U2  -60.01,-32.7 0 top  (outside the outline)
U3  -39.37,31.75 0 top  (outside the outline)
U4  47.24,41.15 90 top
U$1  [CORNER]  5.08,5.08 0 top
U$2  [CORNER]  5.08,52.07 270 top
U$3  [CORNER]  80.01,52.07 180 top
U$4  [CORNER]  80.01,5.08 90 top
U$5  [LOGO]  10.16,1.27 0 top
U$6  34.29,1.27 0 top
U$7  10.16,48.26 0 top

### Tracks (layer width: path | path; a pad name or v marks a point on that pad's centre or on a via)
24V_EMI
  Top 1.27: U1.1 44.38,25.33 C1.1 44.38,19.64 arc90 L1.2
  Bottom 1.27: U1.1 SJ1.2
+3V3  (20 unrouted)
  Top 0.559: 39.47,42.82 39.88,42.42 TP1.1 41.64,42.42 R4.2 41.66,41.66 42.16,41.15 48.26,41.15 49.54,39.86 U4.3 | 58.17,36.32 TP6.1
  pour Top (isolate 0.305): 54.61,35.56 54.61,38.61 49.02,38.61 49.02,35.56
+5V  (1 unrouted)
  pour Top (isolate 0.305): 54.61,34.29 54.61,20.32 48.26,20.32 48.26,34.29
  pour Top (isolate 0.305): 39.37,35.56 45.21,35.56 45.21,38.61 39.37,38.61
+24V  (via drill 0.35)
  Bottom 1.27: SJ1.1 42.74,15.11 v41.27,13.65
  pour Top (isolate 0.406): 54.61,13.97 54.61,10.16 39.37,10.16 39.37,13.97
GND  (via drill 0.35)  (6 unrouted)
  other vias: 46.74,47.5 62.99,9.65 25.15,6.6 55.37,32.26 50.29,17.02 41.15,19.81 44.7,44.45 44.7,43.69 43.94,44.45 43.94,43.69 43.18,43.69 43.18,44.45 44.7,45.21 43.18,45.21 43.94,45.21 49.53,43.69 50.29,43.69 51.05,43.69 49.53,44.45 49.53,45.21 50.29,44.45 50.29,45.21 51.05,45.21 51.05,44.45 46.74,39.88 52.83,41.15 47.75,39.88 40.89,41.15 46.23,26.92 46.23,27.69 45.47,27.69 45.47,26.92 46.23,28.45 45.47,28.45 52.58,17.02
  pour Top (isolate 0.406, rank 3): 39.37,46.99 39.37,35.56 54.61,35.56 54.61,46.99
  pour Top (isolate 0.305, rank 3): 0,0 85.09,0 85.09,57.15 0,57.15
  pour Bottom (isolate 0.305, rank 3): 0,0 85.09,0 85.09,57.15 0,57.15
  pour Top (isolate 0.305, rank 2): 54.61,34.29 54.61,10.16 39.37,10.16 39.37,34.29
  pour Bottom (isolate 0.406, rank 2): 39.37,34.29 39.37,10.16 54.61,10.16 54.61,34.29
  pour Bottom (isolate 0.406): 39.37,46.99 54.61,46.99 54.61,35.56 39.37,35.56
  pour Top (isolate 0.305): -57.15,46.99 -13.97,46.99 -13.97,12.7 -57.15,12.7
N$4  (2 unrouted)
N$5
  Top 0.305: D4.A 50.53,41.88 43.6,41.88 41.66,43.83 R4.1
N$6
  Top 0.559: R1.1 50.53,18.57 D2.A
N$7  (2 unrouted)
N$11  (1 unrouted)
N$45  (2 unrouted)
PRTPWR1  (1 unrouted)
SCL  (2 unrouted)
SDA  (2 unrouted)
USBDN1_DM  (1 unrouted)
USBDN1_DP  (1 unrouted)
USBUP_DM  (1 unrouted)
USBUP_DP  (1 unrouted)
VBUS_UP  (2 unrouted)
VDDAPLL  (2 unrouted)
VDDCR  (2 unrouted)

### Text on the board
tPlace: Enables devices on RJ12-I2C comm / system to interface with RJ45-dI2C-USB / comm system. Converts 24V & dI2C on / RJ45 to 3V3 & I2C on RJ12. | GND | 3.3V | GND | 5V | GND | 3.3V | 5V to 3.3V@400mA / Linear Regulator w/ LED | 5V | GND | GND | 24V | 24V to 5V@1A Switching Regulator / w/Optional EMI Filter + Indicator LED
bPlace: EMI / Bypass